# EAGLE design fmspeaker1 (EAGLE 4.11)
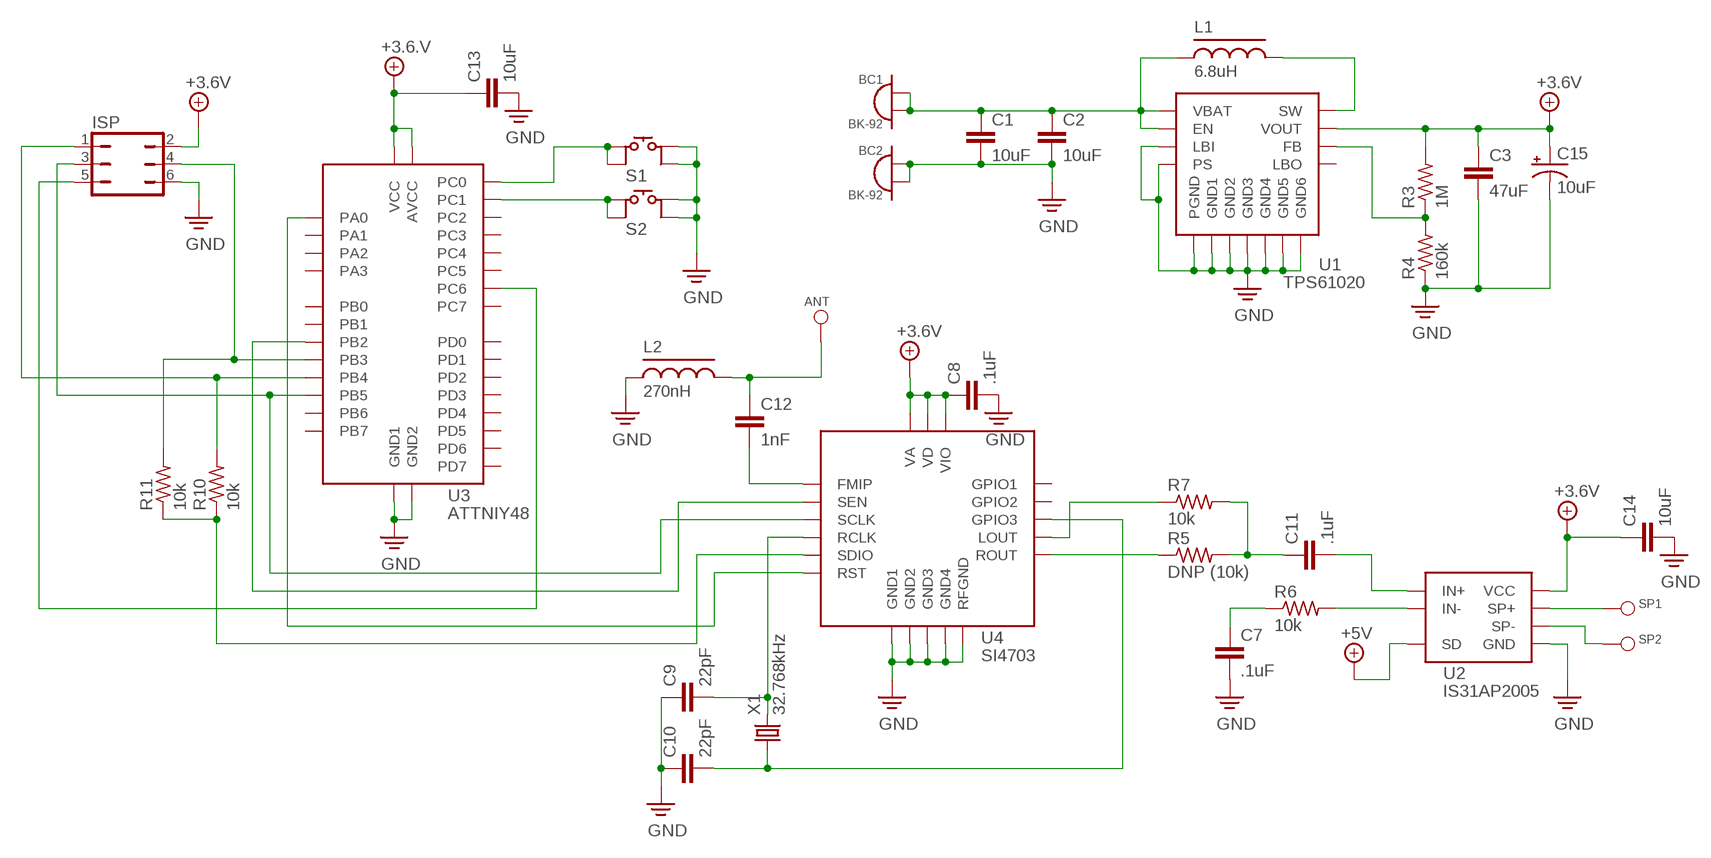
[diagram p0: schematic, sheet 1]

## Parts
ANT  PADWIRE-PAD/SMT  [PAD/SMT/WIRE-PAD]
BC1  BK-92  BATCLIP  [BATCLIP/AA/BK-92]
BC2  BK-92  BATCLIP  [BATCLIP/AA/BK-92]
C1  10uF  CAPACITOR0805-SM  [0805/SMALL]
C2  10uF  CAPACITOR0805-SM  [0805/SMALL]
C3  47uF  CAPACITOR0805-SM  [0805/SMALL]
C7  .1uF  CAPACITOR0603=SM  [0603-SM]
C8  .1uF  CAPACITOR0603=SM  [0603-SM]
C9  22pF  CAPACITOR0603=SM  [0603-SM]
C10  22pF  CAPACITOR0603=SM  [0603-SM]
C11  .1uF  CAPACITOR0603=SM  [0603-SM]
C12  1nF  CAPACITOR0603=SM  [0603-SM]
C13  10uF  CAPACITOR0805-SM  [0805/SMALL]
C14  10uF  CAPACITOR0805-SM  [0805/SMALL]
C15  10uF  CAPACITOR-POL3528-21  [3528-21]
ISP  JMP/6P/DIPPAD  [JMP/6P/DIP/PAD]
L1  6.8uH  INDUCTORSRN6045  [SRN6045]
L2  270nH  INDUCTOR0603/SM  [0603-SM]
R3  1M  RESISTOR0603-SM  [0603-SM]
R4  160k  RESISTOR0603-SM  [0603-SM]
R5  DNP (10k)  RESISTOR0603-SM  [0603-SM]
R6  10k  RESISTOR0603-SM  [0603-SM]
R7  10k  RESISTOR0603-SM  [0603-SM]
R10  10k  RESISTOR0603-SM  [0603-SM]
R11  10k  RESISTOR0603-SM  [0603-SM]
S1  SWITCH/TACTSMT  [SWITCH/TACT/SMT-PTS645]
S2  SWITCH/TACTSMT  [SWITCH/TACT/SMT-PTS645]
SP1  PADWIRE-PAD/SMT  [PAD/SMT/WIRE-PAD]
SP2  PADWIRE-PAD/SMT  [PAD/SMT/WIRE-PAD]
U1  TPS61020  TPS6102X10-VFDFN  [10-VFDFN]
U2  IS31AP2005  AMP/POWERIS31AP2005  [8-MSOP]
U3  ATTNIY48  ATTINY4832-TQFP  [32-TQFP]
U4  SI4703  [20-QFN]
X1  32.768kHz  CRYSTALSMT  [CRYSTAL/SMT]

## Nets
+5V: C3.1 C8.P$1 C13.1 C14.1 C15.P$1(+) ISP.2 R3.P$2 U1.P$2(VOUT) U2.P$1(SD) U2.P$6(VCC) U3.4(VCC) U3.18(AVCC) U4.P$10(VIO) U4.P$11(VD) U4.P$16(VA) ; supply symbol labelled +3.6V, +3.6.V
N$1: BC1.P$1 BC1.P$2 C1.1 C2.1 L1.P$1 U1.P$1(EN) U1.P$6(VBAT)
N$2: C11.P$1 R5.P$2 R7.P$2
N$5: L1.P$2 U1.P$9(SW)
N$6: R3.P$1 R4.P$2 U1.P$3(FB)
N$7: C12.P$2 U4.P$2(FMIP)
N$8: ISP.4 R11.P$2 U3.15(PB3)
N$9: ISP.5 U3.29(PC6)
N$10: SP1.P$1 U2.P$5(SP+)
N$11: SP2.P$1 U2.P$8(SP-)
N$12: ISP.3 U3.17(PB5) U4.P$7(SCLK)
N$13: ISP.1 R10.P$2 U3.16(PB4)
N$14: C9.P$2 U4.P$9(RCLK) X1.P$4
N$15: C11.P$2 U2.P$3(IN+)
N$16: R6.P$2 U2.P$4(IN-)
N$17: C7.P$1 R6.P$1
N$18: S2.P$1 S2.P$4 U3.24(PC1)
N$19: S1.P$1 S1.P$4 U3.23(PC0)
N$20: ANT.P$1 C12.P$1 L2.P$2
N$21: R5.P$1 U4.P$13(ROUT)
N$22: R7.P$1 U4.P$14(LOUT)
N$23: U3.14(PB2) U4.P$6(SEN)
N$24: R10.P$1 R11.P$1 U4.P$8(SDIO)
N$25: C10.P$2 U4.P$17(GPIO3) X1.P$1
N$28: U3.19(PA0) U4.P$5(RST)
PE: BC2.P$1 BC2.P$2 C1.2 C2.2 C3.2 C7.P$2 C8.P$2 C9.P$1 C10.P$1 C13.2 C14.2 C15.P$2(-) ISP.6 L2.P$1 R4.P$1 S1.P$2 S1.P$3 S2.P$2 S2.P$3 U1.P$5(GND1) U1.P$7(LBI) U1.P$8(PS) U1.P$10(PGND) U1.P$11(GND6) U1.P$12(GND5) U1.P$13(GND4) U1.P$14(GND3) U1.P$15(GND2) U2.P$7(GND) U3.5(GND1) U3.21(GND2) U4.P$3(RFGND) U4.P$4(GND1) U4.P$12(GND4) U4.P$15(GND2) U4.P$21(GND3) ; supply symbol labelled GND
Unconnected: U1.P$4(LBO) U3.1(PD3) U3.2(PD4) U3.3(PA2) U3.6(PA3) U3.7(PB6) U3.8(PB7) U3.9(PD5) U3.10(PD6) U3.11(PD7) U3.12(PB0) U3.13(PB1) U3.20(PC7) U3.22(PA1) U3.25(PC2) U3.26(PC3) U3.27(PC4) U3.28(PC5) U3.30(PD0) U3.31(PD1) U3.32(PD2) U4.P$18(GPIO2) U4.P$19(GPIO1)

## Library data of the parts
ANT SP1 SP2 = audioint:PAD
BC1 BC2 = audioint:BATCLIP
C1-C3 C7-C14 = audioint:CAPACITOR
C15 = audioint:CAPACITOR-POL
ISP = audioint:JMP/6P/DIP
L1 L2 = audioint:INDUCTOR
R3-R7 R10 R11 = audioint:RESISTOR
S1 S2 = audioint:SWITCH/TACT
U1 = audioint:TPS6102X
U2 = audioint:AMP/POWER
U3 = audioint:ATTINY48
U4 = audioint:SI4703
X1 = audioint:CRYSTAL

## Board
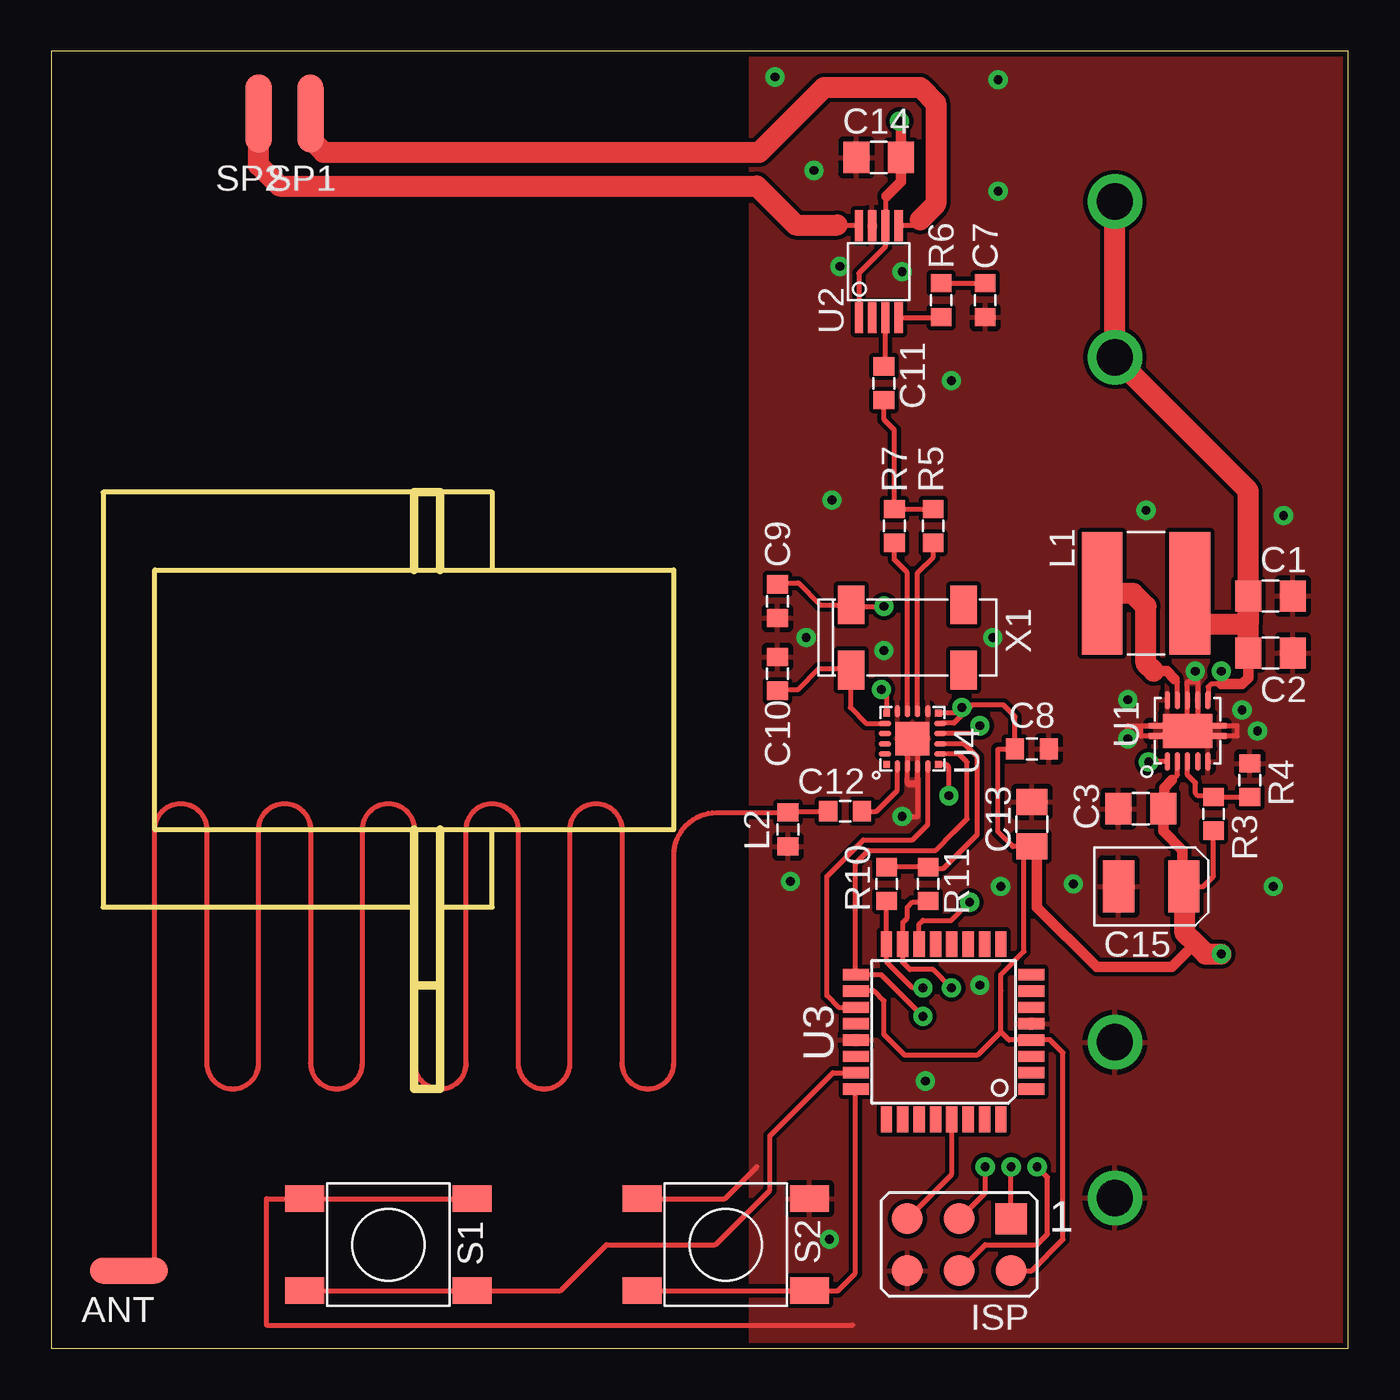
[diagram p1: board, top side]
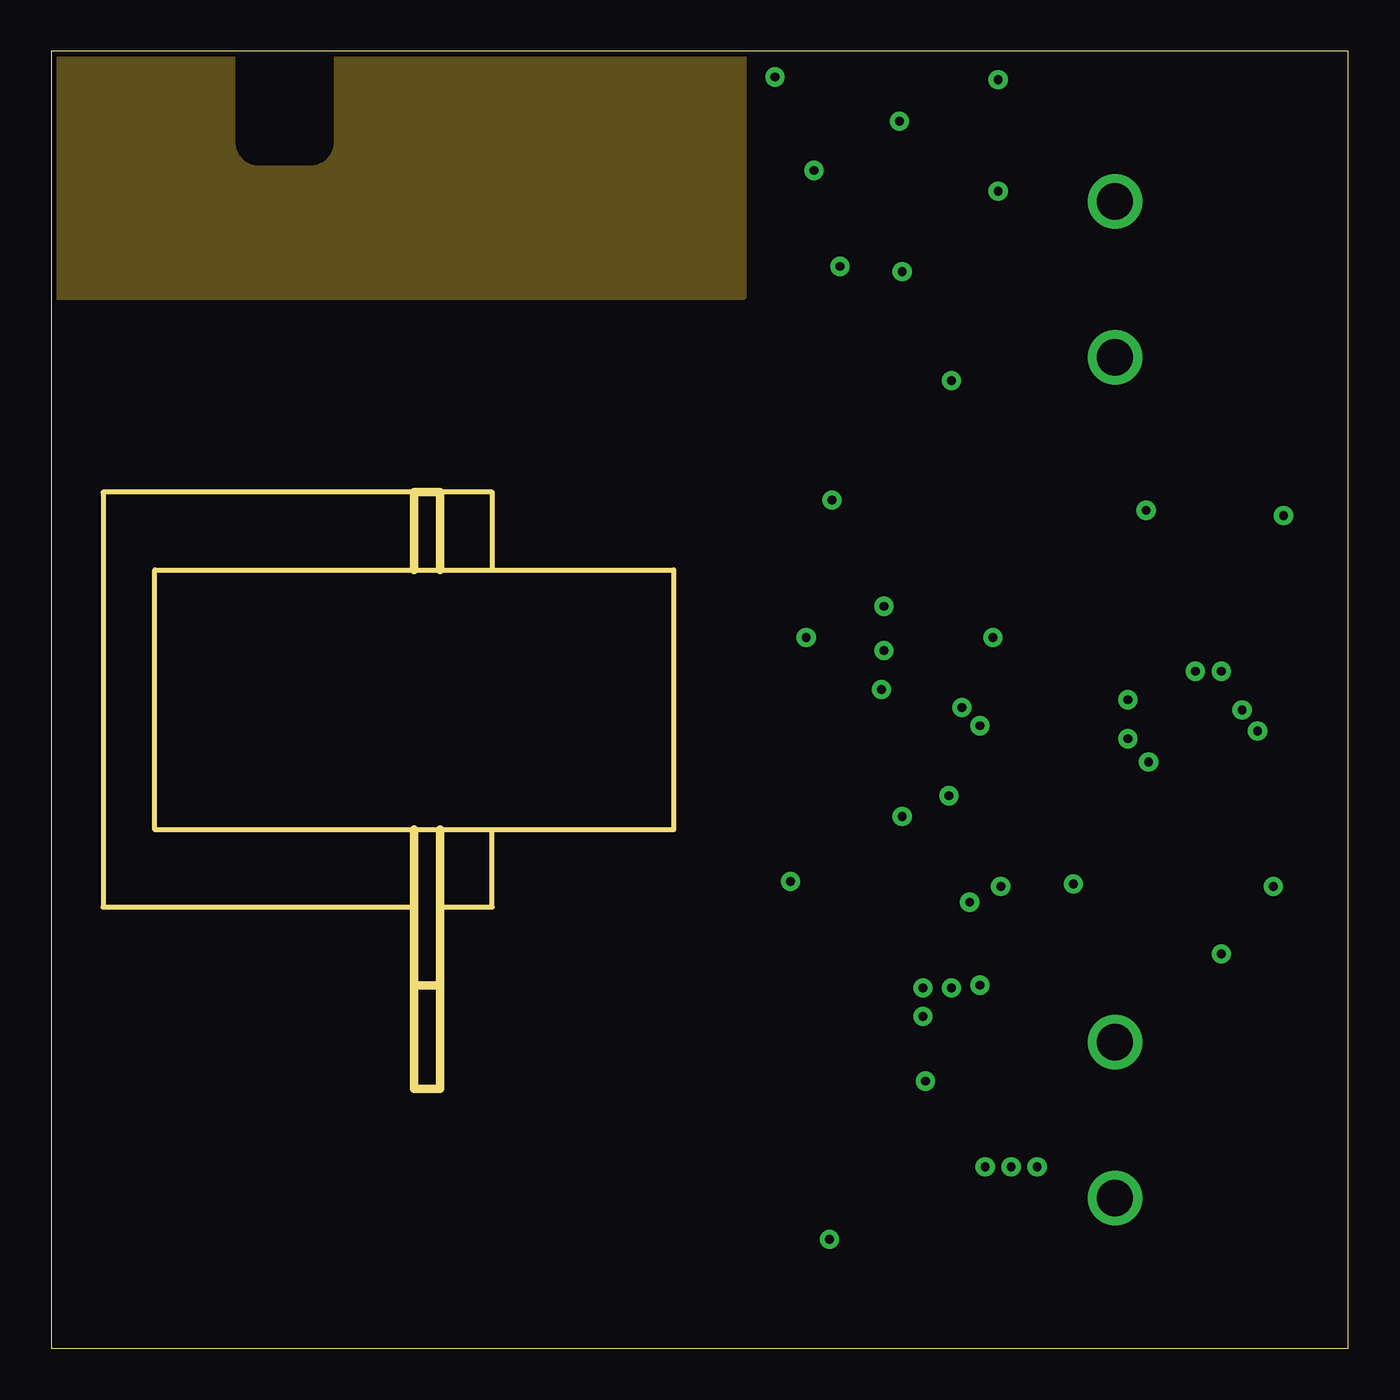
[diagram p2: board, inner layer Route2]
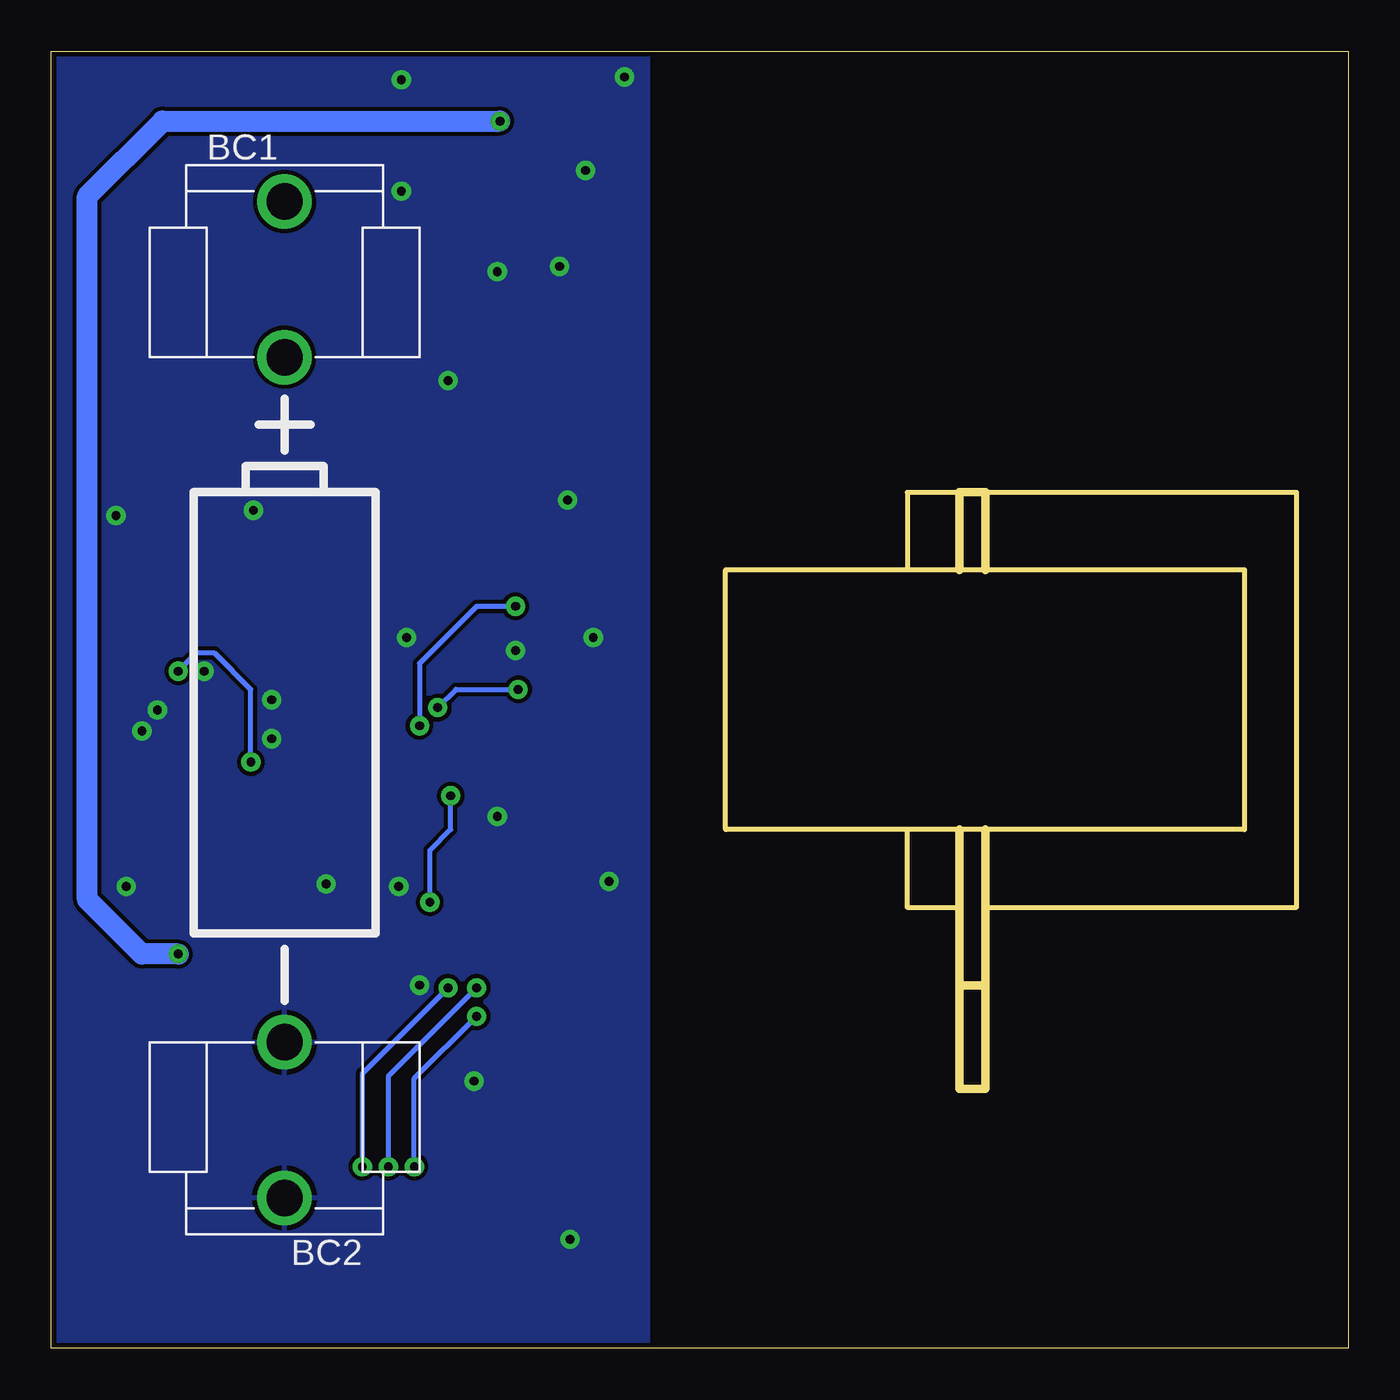
[diagram p3: board, bottom side, seen from below]

Size 63.5 x 63.5 mm. Coordinates in mm from the lower left corner, seen from the top.
Outline: 63.5,0 63.5,63.5 0,63.5 0,0 63.5,0
Copper layers (1*16): Top 0.035mm / dielectric 1.5mm / Bottom 0.035mm
Design rules "default": minimum track width 8mil, minimum drill 16mil, track to track 8mil, track to pad 8mil, pad to pad 8mil, via to via 8mil, smd to smd 8mil, copper to edge 10mil, drill to drill 8mil, minimum pad ring 10mil, minimum via ring 8mil, stop-mask expansion 4mil, vias tented up to drill 20mil, thermal gap 10mil
tRestrict: area 42.1,28.3 to 42.3,28.7; area 55.8,31.4 to 56,32.1
Milling: 28 lines

### Footprints (pad centres in the part's own frame; a part is rotated, then mirrored left to right if it is on the bottom)
PAD/SMT/WIRE-PAD = smd 1.27 x 3.81: P$1 0,0
BATCLIP/AA/BK-92 = drill 1.778 round: P$1 0,0; P$2 0,7.62
0805/SMALL = smd 1.27 x 1.524: 1 -1.091,0; 2 1.091,0
0603-SM = smd 0.889 x 1.016: P$1 -0.826,0; P$2 0.826,0
3528-21 = smd 1.524 x 2.54: P$1 -1.6,0; P$2 1.6,0
JMP/6P/DIP/PAD = smd 1.524 x 1.524: 1 -2.54,-1.27; 2 -2.54,1.27; 3 0,-1.27; 4 0,1.27; 5 2.54,-1.27; 6 2.54,1.27
SRN6045 = smd 6 x 2: P$1 0,-2.15; P$2 0,2.15
SWITCH/TACT/SMT-PTS645 = smd 1.9 x 1.3: P$1 -4.1,2.25; P$2 -4.1,-2.25; P$3 4.1,-2.25; P$4 4.1,2.25
10-VFDFN = smd 0.9 x 0.28: P$1 -1.5,1; P$2 -1.5,0.5; P$3 -1.5,0; P$4 -1.5,-0.5; P$5 -1.5,-1; P$6 1.5,-1; P$7 1.5,-0.5; P$8 1.5,0; P$9 1.5,0.5; P$10 1.5,1 | smd 1.65 x 2.4: P$11 0,0 | smd 0.28 x 0.7: P$12 -0.25,1.55; P$13 0.25,1.55; P$14 -0.25,-1.55; P$15 0.25,-1.55
8-MSOP = smd 1.5 x 0.4: P$1 -2.25,0.975; P$2 -2.25,0.325; P$3 -2.25,-0.325; P$4 -2.25,-0.975; P$5 2.25,-0.975; P$6 2.25,-0.325; P$7 2.25,0.325; P$8 2.25,0.975
32-TQFP = smd 1.27 x 0.559: 1 -4.293,2.8; 2 -4.293,2; 3 -4.293,1.2; 4 -4.293,0.4; 5 -4.293,-0.4; 6 -4.293,-1.2; 7 -4.293,-2; 8 -4.293,-2.8; 17 4.293,-2.8; 18 4.293,-2; 19 4.293,-1.2; 20 4.293,-0.4; 21 4.293,0.4; 22 4.293,1.2; 23 4.293,2; 24 4.293,2.8 | smd 0.559 x 1.27: 9 -2.8,-4.293; 10 -2,-4.293; 11 -1.2,-4.293; 12 -0.4,-4.293; 13 0.4,-4.293; 14 1.2,-4.293; 15 2,-4.293; 16 2.8,-4.293; 25 2.8,4.293; 26 2,4.293; 27 1.2,4.293; 28 0.4,4.293; 29 -0.4,4.293; 30 -1.2,4.293; 31 -2,4.293; 32 -2.8,4.293
20-QFN = smd 0.34 x 0.34: P$1 -1.265,1.265; P$6 -1.265,-1.265; P$11 1.265,-1.265; P$16 1.265,1.265 | smd 0.6 x 0.28: P$2 -1.35,0.75; P$3 -1.35,0.25; P$4 -1.35,-0.25; P$5 -1.35,-0.75; P$12 1.35,-0.75; P$13 1.35,-0.25; P$14 1.35,0.25; P$15 1.35,0.75 | smd 0.28 x 0.6: P$7 -0.75,-1.35; P$8 -0.25,-1.35; P$9 0.25,-1.35; P$10 0.75,-1.35; P$17 0.75,1.35; P$18 0.25,1.35; P$19 -0.25,1.35; P$20 -0.75,1.35 | smd 1.65 x 1.65: P$21 0,0
CRYSTAL/SMT = smd 1.9 x 1.3: P$1 -1.6,2.75; P$2 -1.6,-2.75; P$3 1.6,-2.75; P$4 1.6,2.75

### Placement (x,y rotation side)
ANT  3.81,3.81 90 top
BC1  52.07,48.51 0 bottom
BC2  52.07,14.99 180 bottom
C1  59.69,36.83 0 top
C2  59.69,34.04 0 top
C3  53.34,26.42 180 top
C7  45.72,51.31 270 top
C8  48.01,29.34 0 top
C9  35.56,36.58 90 top
C10  35.56,33.02 270 top
C11  40.77,47.24 90 top
C12  38.86,26.29 0 top
C13  48.01,25.65 90 top
C14  40.51,58.29 180 top
C15  53.85,22.61 180 top
ISP  44.45,5.08 180 top
L1  53.59,36.96 90 top
L2  36.07,25.4 90 top
R3  56.9,26.16 270 top
R4  58.67,27.81 270 top
R5  43.18,40.26 90 top
R6  43.56,51.31 270 top
R7  41.27,40.26 90 top
R10  40.89,22.73 270 top
R11  42.93,22.73 270 top
S1  16.51,5.08 180 top
S2  33.02,5.08 180 top
SP1  12.7,60.45 180 top
SP2  10.16,60.45 180 top
U1  55.63,30.23 90 top
U2  40.51,52.7 90 top
U3  43.69,15.49 180 top
U4  42.16,29.84 90 top
X1  41.91,34.8 90 top

### Tracks (layer width: path | path; a pad name or v marks a point on that pad's centre or on a via)
+5V  (via drill 0.43 pad 0.94)
  Top 0.254: C15.P$1 56.39,22.61 56.9,23.11 R3.P$2 | U1.P$2 55.13,28.07 54.86,27.81 | 44.7,31.11 45.09,31.5 46.61,31.5 47.18,30.92 C8.P$1 46.35,29.34 46.35,25.27 47.06,24.56 47.62,24.56 | 44.7,31.11 44.2,30.61 43.56,30.61 43.55,30.59 U4.P$10 | 44.58,31.11 44.7,31.11 | 44.58,31.11 U4.P$11 | 47.62,24.56 C13.1 | 47.88,15.09 46.88,15.09 46.48,15.49 | 47.88,15.09 U3.4 | 46.48,15.49 46.48,17.53 | 46.48,17.53 46.48,18.29 47.62,19.43 47.62,24.56 | 47.88,15.09 47.88,15.11 48.9,15.11 49.53,14.48 49.53,5.33 48.01,3.81 ISP.2 | 46.48,17.53 46.48,17.49 | U4.P$16 40.9,32 v40.64,32.26 | 44.58,31.11 v44.58,31.37 | U3.18 40.29,17.49 40.77,17.02 40.77,15.37 41.78,14.35 45.34,14.35 46.48,15.49 | 40.89,56.39 40.89,56.33 | 40.89,56.33 40.84,56.33 U2.P$6 40.84,53.92 39.54,52.62 U2.P$1 | 40.89,56.33 40.89,56.26
  Top 0.508: 54.86,27.81 54.48,27.43 54.48,26.42 C3.1 54.43,25.32 55.37,24.38 55.37,22.61 C15.P$1 | v41.53,60.07 41.6,60 C14.1 41.6,57.1 40.89,56.39 | 56.01,19.81 54.86,18.67 51.18,18.67 48.26,21.59 48.26,24.51 48.06,24.51 C13.1
  Top 1.016: v57.28,19.3 56.52,19.3 56.01,19.81 55.5,20.32 55.5,22.48 55.45,22.53 C15.P$1
  Bottom 0.254: v40.64,32.26 43.69,32.26 v44.58,31.37
  Bottom 1.016: v41.53,60.07 58.04,60.07 61.72,56.39 61.72,21.97 59.05,19.3 v57.28,19.3
N$1  (via drill 0.43 pad 0.94)
  Top 0.254: 57.28,32.51 56.77,32.51 56.64,32.38 56.64,31.75 U1.P$6 | U1.P$1 53.74,28.73 v53.72,28.7 | v57.28,33.15 57.4,33.02 57.4,32.51
  Top 0.508: C2.1 58.6,32.82 58.29,32.51 57.4,32.51 57.28,32.51
  Top 1.016: BC1.P$2 BC1.P$1 58.6,41.98 C1.1 | 55.88,36.83 L1.P$1 55.88,36.96 55.88,35.43 58.6,35.43 C1.1 | C2.1 C1.1 | C1.1 58.67,36.83
  Bottom 0.254: v57.28,33.15 56.39,34.04 55.5,34.04 53.72,32.26 v53.72,28.7
N$2
  Top 0.254: R5.P$2 41.34,41.08 41.27,41.15 R7.P$2 41.27,44.96 40.77,45.47 C11.P$1 40.77,46.48
N$4
  pour Route2: 0,63.5 8.89,63.5 8.89,59.05 arc90 10.16,57.78 12.7,57.78 arc90 13.97,59.05 13.97,63.5 33.91,63.5 33.91,51.44 0,51.44
N$5
  Top 0.254: U1.P$9 55.13,32.63 54.99,32.77
  Top 0.508: 53.98,33.15 54.61,33.15 54.99,32.77
  Top 1.016: L1.P$2 52.96,36.96 53.59,36.32 53.59,33.53 53.98,33.15
N$6
  Top 0.254: R4.P$2 58.67,27.05 58.61,26.99 R3.P$1 56.9,27.05 56.13,27.05 56.01,27.18 56.01,27.69 55.63,28.07 U1.P$3
N$7
  Top 0.254: U4.P$2 41.41,27.32 40.39,26.29 C12.P$2 39.62,26.29
N$8  (via drill 0.43 pad 0.94)
  Top 0.254: R11.P$2 42.99,21.91 43.05,21.84 42.16,21.84 41.91,21.59 41.91,21.08 41.69,20.86 U3.15 41.69,18.89 42.04,18.54 43.18,18.54 v44.07,17.65 | v48.26,8.89 48.77,8.38 48.77,5.59 48.26,5.08 45.72,5.08 ISP.4
  Bottom 0.254: v44.07,17.65 48.26,13.46 v48.26,8.89
N$9
  Top 0.254: U3.29 44.09,8.53 ISP.5
N$10
  Top 0.254: U2.P$5 42.26,54.95 42.55,55.24
  Top 1.016: 42.55,55.24 43.31,56.01 43.31,60.96 42.55,61.72 37.85,61.72 34.67,58.55 13.34,58.55 12.7,59.18 SP1.P$1
N$11
  Top 0.254: 38.48,54.99 39.5,54.99 39.5,54.86 U2.P$8
  Top 1.016: 10.03,60.58 SP2.P$1 10.16,57.91 11.18,56.9 | 38.48,54.99 36.45,54.99 34.54,56.9 11.18,56.9 | 11.18,56.9 11.05,57.02
N$12  (via drill 0.43 pad 0.94)
  Top 0.254: 44.2,25.27 43.31,24.38 40.01,24.38 39.37,23.75 39.37,18.29 | 44.2,25.27 44.32,25.4 | 39.37,18.29 U3.17 | U4.P$7 44.44,29.09 44.83,28.7 44.83,25.91 44.2,25.27 | 39.37,18.29 40.64,18.29 v42.67,16.26 | v45.72,8.89 45.72,7.62 ISP.3
  Bottom 0.254: v42.67,16.26 45.72,13.21 v45.72,8.89
N$13  (via drill 0.43 pad 0.94)
  Top 0.254: R10.P$2 40.89,21.97 40.89,21.96 U3.16 40.89,18.93 42.16,17.65 v42.67,17.65 | ISP.1 v46.99,8.89
  Bottom 0.254: 46.99,12.57 46.99,12.7 | v42.67,17.65 46.99,13.34 46.99,12.57 | v46.99,8.89 46.99,12.57
N$14  (via drill 0.43 pad 0.94)
  Top 0.254: 38.86,36.4 X1.P$4 | 38.86,36.4 37.64,36.4 36.58,37.47 35.69,37.47 35.62,37.4 C9.P$2 | U4.P$9 45.08,30.09 v45.47,30.48 | 38.86,36.4 38.86,36.32 v40.77,36.32
  Bottom 0.254: v45.47,30.48 45.47,33.53 42.67,36.32 v40.77,36.32
N$15
  Top 0.254: 40.84,48.06 40.83,48.07 C11.P$2 | 40.84,48.06 U2.P$3 | 40.84,48.06 40.89,48.01
N$16
  Top 0.254: 43.62,50.48 43.69,50.55 | 43.62,50.48 R6.P$2 | U2.P$4 43.6,50.45 43.62,50.48
N$17
  Top 0.254: 45.78,52.13 C7.P$1 | R6.P$1 45.78,52.13 | 45.78,52.13 45.85,52.07
N$18
  Top 0.254: S2.P$1 37.17,2.83 37.21,2.79 | S2.P$4 S2.P$1 | S2.P$1 38.52,2.83 39.37,3.68 39.37,12.57 39.49,12.69 | 39.49,12.69 39.5,12.7 | 39.49,12.69 U3.24
N$19
  Top 0.254: S1.P$1 20.79,2.83 20.83,2.79 | S1.P$4 S1.P$1 | S1.P$1 24.93,2.83 27.18,5.08 32.51,5.08 35.18,7.75 35.18,10.41 38.26,13.49 U3.23
N$20
  Top 0.254: C12.P$1 36.07,26.29 L2.P$2 32.58,26.23 arc90 30.48,24.13 30.48,13.97 arc-90 29.21,12.7 arc-90 27.94,13.97 27.94,25.4 arc90 26.67,26.67 arc90 25.4,25.4 25.4,13.97 arc-90 24.13,12.7 arc-90 22.86,13.97 22.86,25.4 arc90 21.59,26.67 arc90 20.32,25.4 20.32,13.97 arc-90 19.05,12.7 arc-90 17.78,13.97 17.78,25.4 arc90 16.51,26.67 arc90 15.24,25.4 15.24,13.97 arc-90 13.97,12.7 arc-90 12.7,13.97 12.7,25.4 arc90 11.43,26.67 arc90 10.16,25.4 10.16,13.97 arc-90 8.89,12.7 arc-90 7.62,13.97 7.62,25.4 arc90 6.35,26.67 arc90 5.08,25.4 5.08,3.81 ANT.P$1
N$21
  Top 0.254: U4.P$13 42.41,37.97 43.18,38.73 R5.P$1 43.18,39.5
N$22
  Top 0.254: U4.P$14 41.91,37.97 41.27,38.61 R7.P$1 41.27,39.62
N$23  (via drill 0.43 pad 0.94)
  Top 0.254: U3.14 42.49,20.77 42.67,20.95 44.07,20.95 v44.96,21.84 | U4.P$6 43.81,28.57 43.94,28.45 v43.94,27.05
  Bottom 0.254: v44.96,21.84 44.96,24.38 43.94,25.4 v43.94,27.05
N$24
  Top 0.254: 42.86,23.56 42.8,23.62 | 42.86,23.56 R11.P$1 42.93,23.5 | 42.93,23.5 43.69,23.5 45.34,25.15 45.34,28.96 44.7,29.59 U4.P$8 | 42.86,23.56 R10.P$1 | 42.86,23.56 42.93,23.5
N$25
  Top 0.254: U4.P$17 39.89,30.59 39.12,31.37 39.12,33.27 | 39.12,33.27 39.16,33.23 X1.P$1 | 39.12,33.27 37.59,33.27 36.58,32.26 35.56,32.26 C10.P$2
N$28
  Top 0.254: U4.P$5 42.91,25.64 42.16,24.89 39.75,24.89 37.97,23.11 37.97,17.27 38.55,16.69 U3.19
PE  (via drill 0.43 pad 0.94)
  Top 0.254: 20.7,7.37 20.7,7.33 S1.P$2 12.16,7.33 12.06,7.24 12.06,7.33 | S2.P$3 29.08,7.33 | 29.08,7.33 29.08,7.37 | 12.06,7.33 10.54,7.33 10.54,1.14 39.24,1.14 | 12.06,7.33 S1.P$3 | 29.08,7.33 32.98,7.33 34.54,8.89 | U1.P$12 53.34,29.98 53.34,29.97 53.34,30.48 54.13,30.48 | U1.P$14 58.04,29.98 58.04,30.48 57.15,30.48 U1.P$15 | 55.63,33.15 v56.01,33.15 56.13,33.15 56.13,32.64 | U4.P$3 41.91,27.69 41.94,27.69 | 42.42,27.69 41.94,27.69 | 42.42,27.69 42.42,26.04 v41.66,26.04 | 56.13,32.64 55.63,32.64 U1.P$8 U1.P$11 | 56.13,32.64 56.13,31.77 | 56.13,31.75 56.13,31.62 | U1.P$13 52.7,30.48 v52.7,29.84 | 56.13,31.75 56.13,30.73 | 42.42,27.69 42.42,29.34 42.04,29.34 | 42.04,29.34 41.91,29.34 41.91,28.45 | 42.04,29.34 42.04,29.46 42.16,29.46 U4.P$21 | 41.94,27.69 41.94,27.61 42.41,27.61 U4.P$4 | 56.13,31.77 U1.P$7 | 56.13,31.77 56.13,31.75
  other vias: 59.82,22.61 50.04,22.73 59.05,30.23 60.33,40.77 53.59,41.02 37.34,57.66 41.66,52.7 38.61,52.96 46.35,56.64 44.07,47.37 38.23,41.53 36.2,22.86 36.96,34.8 46.1,34.8 40.77,34.16 45.47,17.78 42.8,13.08 38.1,5.33 52.7,31.75 58.29,31.24 46.48,22.61 35.43,62.23 46.35,62.1
  pour Top: 63.5,0 34.29,0 34.29,63.5 63.5,63.5
  pour Bottom: 63.5,0 34.29,0 34.29,63.5 63.5,63.5

### Text on the board
tPlace: 1